# EAGLE schematic heatgun (EAGLE 7.6.0)
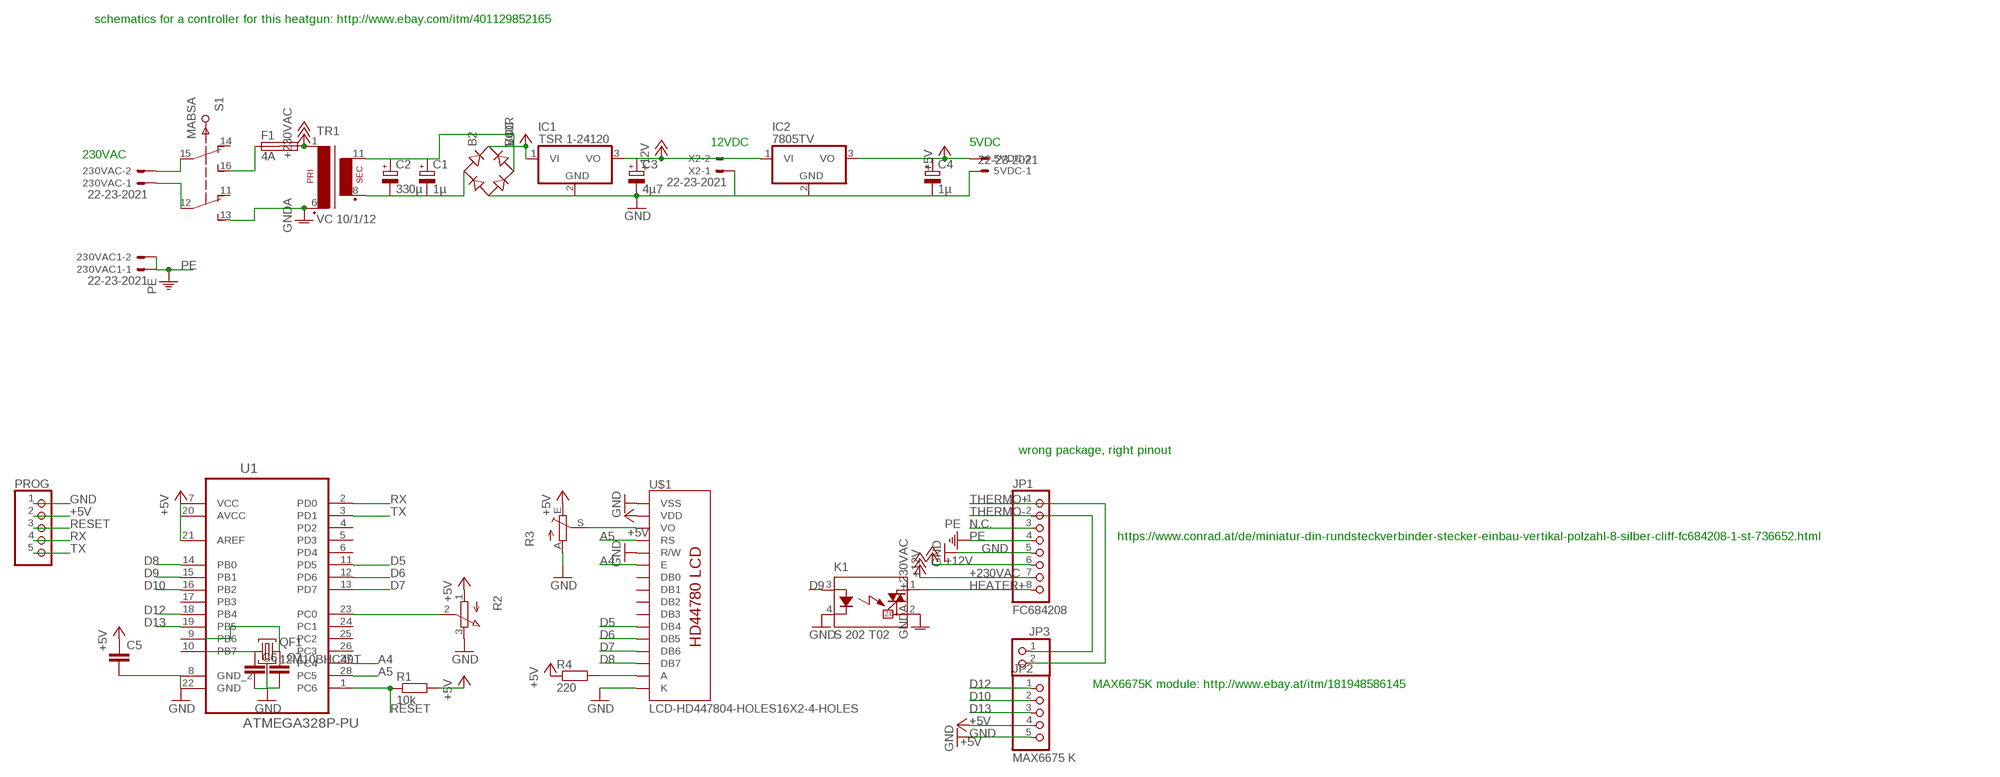
[diagram p0: schematic, sheet 1]

## Parts
5VDC  22-23-2021  [22-23-2021]
230VAC  22-23-2021  [22-23-2021]
230VAC1  22-23-2021  [22-23-2021]
B2  B40R  RECTIFIER-RB1A  [RB1A]
C1  1µ  CPOL-EUE10-25  [EB25D]
C2  330µ  CPOL-EUE2-4  [E2-4]
C3  4µ7  CPOL-EUE2-4  [E2-4]
C4  1µ  CPOL-EUE2-4  [E2-4]
C5  C-EU025-025X050  [C025-025X050]
C6  C-EU025-024X044  [C025-024X044]
C7  C-EU025-024X044  [C025-024X044]
F1  4A  SHK20L  [SHK20L]
IC1  TSR 1-24120  7812TV  [TO220V]
IC2  7805TV  [TO220V]
JP1  FC684208  PINHD-1X8  [1X08]
JP2  MAX6675 K  PINHD-1X5  [1X05]
JP3  PINHD-1X2  [1X02]
K1  S 202 T02  S102S02  [S202S02]
PROG  PINHD-1X5  [1X05]
QF1  12M10BHC49T  [HC49U]
R1  10k  R-EU_0207/2V  [0207/2V]
R2  3RP/1610N  [3RP/1610N]
R3  TRIM_EU-B64Y  [B64Y]
R4  220  R-EU_0207/2V  [0207/2V]
S1  MABSA  [MABSA]
TR1  VC 10/1/12  EI48-1  [EI48-1]
U1  ATMEGA328P-PU  [DIP254P762X457-28]
U$1  LCD-HD447804-HOLES16X2-4-HOLES  [LCD-16X2-4HOLES]
X2  22-23-2021  [22-23-2021]

## Nets
+5V: 5VDC.2 C4.+ C5.1 IC2.3(VO) JP2.4 PROG.2 R1.2 R2.1(A) R3.E R4.1 U1.7(VCC) U1.20(AVCC) U1.21(AREF) U$1.2(VDD)
+12V: C3.+ IC1.3(VO) IC2.1(VI) JP1.6 X2.2
+230VAC: F1.2A JP1.7 TR1.1
A4: U1.27(PC4) U$1.6(E)
A5: U1.28(PC5) U$1.4(RS)
D5: U1.11(PD5) U$1.11(DB4)
D6: U1.12(PD6) U$1.12(DB5)
D7: U1.13(PD7) U$1.13(DB6)
D8: U1.14(PB0) U$1.14(DB7)
D9: K1.3(A) U1.15(PB1)
D10: JP2.2 U1.16(PB2)
D12: JP2.1 U1.18(PB4)
D13: JP2.3 U1.19(PB5)
GND: 5VDC.1 B2.- C3.- C4.- C5.2 C6.2 C7.2 IC1.2(GND) IC2.2(GND) JP1.5 JP2.5 K1.4(K) PROG.1 QF1.2 R2.3(E) R3.A U1.8(GND_2) U1.22(GND) U$1.1(VSS) U$1.5(R/W) U$1.16(K) X2.1
GNDA: K1.2(DS2) S1.13 TR1.6(P2)
HEATER+: JP1.8 K1.1(DS1)
N$2: 230VAC.2 S1.15
N$3: 230VAC.1 S1.12
N$4: B2.AC1 C1.- C2.- TR1.8(S3)
N$5: B2.AC2 C1.+ C2.+ TR1.11(S4)
N$6: R2.2(S) U1.23(PC0)
N$7: R3.S U$1.3(VO)
N$8: C6.1 QF1.1
N$9: C7.1 QF1.3
N$10: R4.2 U$1.15(A)
N$12: F1.1A S1.16
N.C.: JP1.3
PE: 230VAC1.1 230VAC1.2 JP1.4
RESET: PROG.3 R1.1 U1.1(PC6)
RX: PROG.4 U1.2(PD0)
THERMO+: JP1.1 JP3.2
THERMO-: JP1.2 JP3.1
TX: PROG.5 U1.3(PD1)
VCC: B2.+ IC1.1(VI)
Unconnected: F1.1B F1.2B S1.11 S1.14 U1.4(PD2) U1.5(PD3) U1.6(PD4) U1.9(PB6) U1.10(PB7) U1.17(PB3) U1.24(PC1) U1.25(PC2) U1.26(PC3) U$1.7(DB0) U$1.8(DB1) U$1.9(DB2) U$1.10(DB3)

## Notes on the sheet
- schematics for a controller for this heatgun: http://www.ebay.com/itm/401129852165
- 12VDC | 5VDC
- 230VAC
- wrong package, right pinout
- https://www.conrad.at/de/miniatur-din-rundsteckverbinder-stecker-einbau-vertikal-polzahl-8-silber-cliff-fc684208-1-st-736652.html
- MAX6675K module: http://www.ebay.at/itm/181948586145

## Library data of the parts
5VDC 230VAC 230VAC1 X2 = con-molex:22-23-2021: .100" (2.54mm) Center Header - 2 Pin; MF: MOLEX; MPN: 22-23-2021; OC_FARNELL: 1462926; OC_NEWARK: 25C3832
B2 = rectifier:RECTIFIER-: Rectifier
C1-C4 = rcl:CPOL-EU: POLARIZED CAPACITOR, European symbol
C5-C7 = rcl:C-EU: CAPACITOR, European symbol
F1 = fuse:SHK20L: FUSE HOLDER 5 x 20 mm, SH contact, SHH1 Schukat, E1073 Buerklin; OC_FARNELL: unknown; OC_NEWARK: unknown
IC1 IC2 = linear:78*: Positive VOLTAGE REGULATOR Source: http://cache.national.com/ds/LM/LM78L05.pdf http://www.fairchildsemi.com/ds/LM/LM7805.pdf
JP1 = pinhead:PINHD-1X8: PIN HEADER
JP2 PROG = pinhead:PINHD-1X5: PIN HEADER
JP3 = pinhead:PINHD-1X2: PIN HEADER
K1 = relay:S*02S02: IT(rms) 8A, Zero Cross type SIP 4pin Triac output SSR Source: http://sharp-world.com/products/device/lineup/data/pdf/datasheet/s102s02_e.pdf; OC_FARNELL: unknown; OC_NEWARK: unknown
QF1 = crystal:12M10BHC49T: Monolithic Crystal Filters Source: www.vanlong.com; OC_FARNELL: unknown; OC_NEWARK: unknown
R1 R4 = rcl:R-EU_: RESISTOR, European symbol
R2 = pot:3RP/1610N: 16mm Potentiometer one level Source: http://www.alphapotentiometers.net/html/16mm_pot_2.html
R3 = pot:TRIM_EU-: POTENTIOMETER
S1 = con-hirschmann:MABSA: Dual SWITCH; OC_FARNELL: unknown; OC_NEWARK: unknown
TR1 = trafo:EI48-1: TRANSFORMER 1 primary winding, 1 secondary winding ERA
U1 = Atmel_By_element14_Batch_1-00:ATMEGA328P-PU: 8-bit Microcontroller with In-System Programmable Flash; MPN: ATMEGA328P-PU; OC_FARNELL: 1715487; OC_NEWARK: 15R0268; PACKAGE: PDIP-28; SUPPLIER: Atmel
U$1 = HD44780LCD:LCD-HD44780